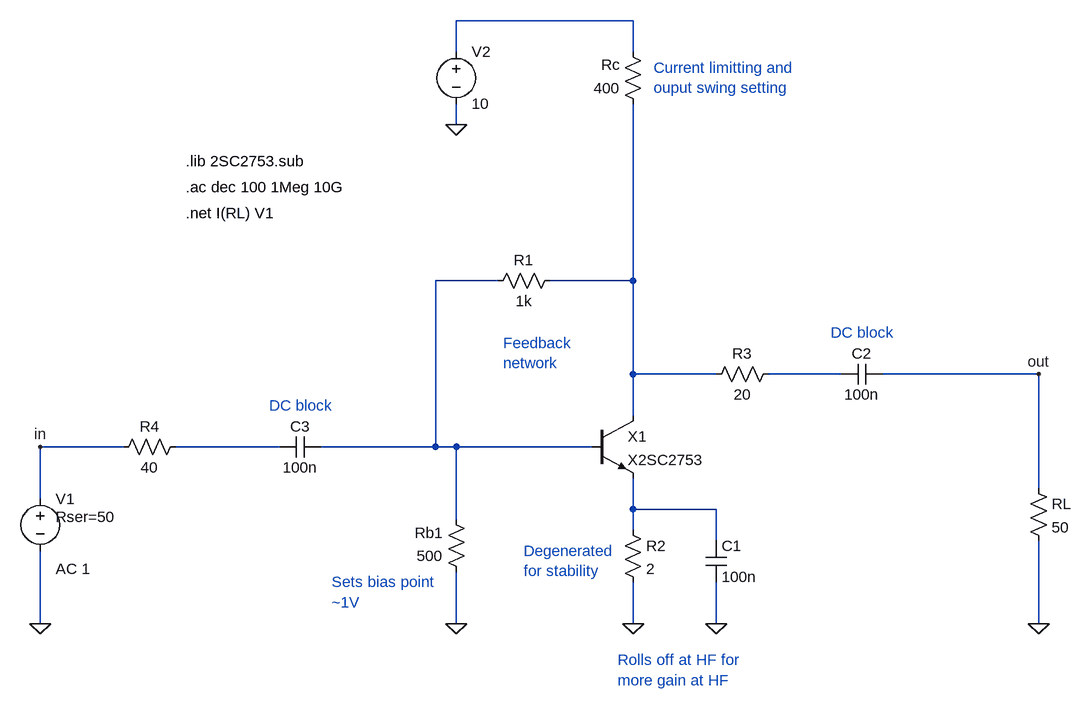
[diagram p0: schematic broadband.asc]
broadband.asc, the LTspice schematic file:
Version 4
SHEET 1 1204 680
WIRE 512 -384 240 -384
WIRE 240 -336 240 -384
WIRE 512 -336 512 -384
WIRE 240 -224 240 -256
WIRE 304 16 208 16
WIRE 512 16 512 -256
WIRE 512 16 384 16
WIRE 512 160 512 16
WIRE 640 160 512 160
WIRE 832 160 720 160
WIRE 1136 160 896 160
WIRE 512 224 512 160
WIRE -272 272 -400 272
WIRE -32 272 -192 272
WIRE 208 272 208 16
WIRE 208 272 32 272
WIRE 240 272 208 272
WIRE 448 272 240 272
WIRE 1136 336 1136 160
WIRE -400 352 -400 272
WIRE 512 368 512 320
WIRE 640 368 512 368
WIRE 240 384 240 272
WIRE 512 400 512 368
WIRE 640 416 640 368
WIRE -400 544 -400 432
WIRE 240 544 240 464
WIRE 512 544 512 480
WIRE 640 544 640 480
WIRE 1136 544 1136 416
FLAG 512 544 0
FLAG 240 544 0
FLAG -400 544 0
FLAG 240 -224 0
FLAG 1136 544 0
FLAG 1136 160 out
FLAG 640 544 0
FLAG -400 272 in
SYMBOL npn 448 224 R0
SYMATTR InstName X1
SYMATTR Value X2SC2753
SYMATTR Prefix X
SYMBOL res 528 -240 R180
WINDOW 0 36 76 Left 2
WINDOW 3 36 40 Left 2
SYMATTR InstName Rc
SYMATTR Value 400
SYMBOL res 256 480 R180
WINDOW 0 36 76 Left 2
WINDOW 3 36 40 Left 2
SYMATTR InstName Rb1
SYMATTR Value 500
SYMBOL cap 896 144 R90
WINDOW 0 0 32 VBottom 2
WINDOW 3 32 32 VTop 2
SYMATTR InstName C2
SYMATTR Value 100n
SYMBOL res 1120 320 R0
SYMATTR InstName RL
SYMATTR Value 50
SYMBOL voltage -400 336 R0
WINDOW 123 24 124 Left 2
WINDOW 39 24 44 Left 2
SYMATTR Value2 AC 1
SYMATTR SpiceLine Rser=50
SYMATTR InstName V1
SYMATTR Value ""
SYMBOL voltage 240 -352 R0
WINDOW 123 0 0 Left 0
WINDOW 39 0 0 Left 0
SYMATTR InstName V2
SYMATTR Value 10
SYMBOL res 400 0 R90
WINDOW 0 0 56 VBottom 2
WINDOW 3 32 56 VTop 2
SYMATTR InstName R1
SYMATTR Value 1k
SYMBOL res 496 384 R0
SYMATTR InstName R2
SYMATTR Value 2
SYMBOL cap 624 416 R0
SYMATTR InstName C1
SYMATTR Value 100n
SYMBOL cap 32 256 R90
WINDOW 0 0 32 VBottom 2
WINDOW 3 32 32 VTop 2
SYMATTR InstName C3
SYMATTR Value 100n
SYMBOL res -176 256 R90
WINDOW 0 0 56 VBottom 2
WINDOW 3 32 56 VTop 2
SYMATTR InstName R4
SYMATTR Value 40
SYMBOL res 736 144 R90
WINDOW 0 0 56 VBottom 2
WINDOW 3 32 56 VTop 2
SYMATTR InstName R3
SYMATTR Value 20
TEXT -176 -168 Left 2 !.lib 2SC2753.sub
TEXT -176 -128 Left 2 !.ac dec 100 1Meg 10G
TEXT -176 -88 Left 2 !.net I(RL) V1
TEXT -48 208 Left 2 ;DC block
TEXT 816 96 Left 2 ;DC block
TEXT 344 432 Left 2 ;Degenerated\nfor stability
TEXT 488 600 Left 2 ;Rolls off at HF for \nmore gain at HF
TEXT 544 -312 Left 2 ;Current limitting and \nouput swing setting
TEXT 312 112 Left 2 ;Feedback\nnetwork
TEXT 48 480 Left 2 ;Sets bias point\n~1V

The netlist it stands for:
* broadband.asc
XX1 N003 N002 N006 X2SC2753  ; pins C B E
Rc N003 N001 400
Rb1 0 N002 500
C2 out N004 100n
RL out 0 50
V1 in 0 AC 1 Rser=50
V2 N001 0 10
R1 N003 N002 1k
R2 N006 0 2
C1 N006 0 100n
C3 N002 N005 100n
R4 N005 in 40
R3 N004 N003 20
.lib 2SC2753.sub
.ac dec 100 1Meg 10G
.net I(RL) V1
* DC block
* DC block
* Degenerated
* for stability
* Rolls off at HF for
* more gain at HF
* Current limitting and
* ouput swing setting
* Feedback
* network
* Sets bias point
* ~1V
.backanno
.end